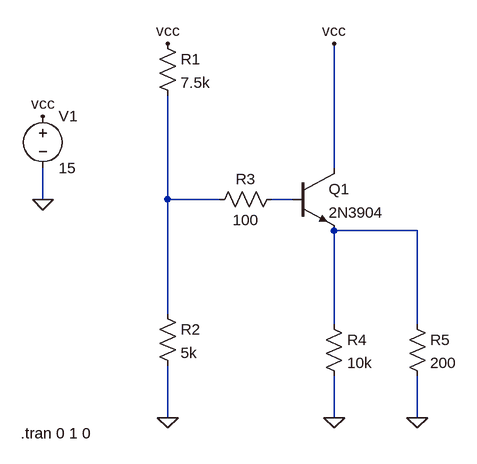
[diagram p0: schematic emiter-follower.asc]
emiter-follower.asc, the LTspice schematic file:
Version 4
SHEET 1 880 680
WIRE 512 192 512 0
WIRE 64 240 64 192
WIRE 256 240 256 80
WIRE 336 240 256 240
WIRE 448 240 416 240
WIRE 640 288 512 288
WIRE 256 416 256 240
WIRE 512 432 512 288
WIRE 640 432 640 288
WIRE 256 576 256 496
WIRE 512 576 512 512
WIRE 640 576 640 512
FLAG 64 240 0
FLAG 256 576 0
FLAG 512 576 0
FLAG 640 576 0
FLAG 64 112 vcc
FLAG 256 0 vcc
FLAG 512 0 vcc
SYMBOL voltage 64 96 R0
WINDOW 123 0 0 Left 0
WINDOW 39 0 0 Left 0
SYMATTR InstName V1
SYMATTR Value 15
SYMBOL npn 448 192 R0
SYMATTR InstName Q1
SYMATTR Value 2N3904
SYMBOL res 240 -16 R0
SYMATTR InstName R1
SYMATTR Value 7.5k
SYMBOL res 240 400 R0
SYMATTR InstName R2
SYMATTR Value 5k
SYMBOL res 496 416 R0
SYMATTR InstName R4
SYMATTR Value 10k
SYMBOL res 624 416 R0
SYMATTR InstName R5
SYMATTR Value 200
SYMBOL res 432 224 R90
WINDOW 0 0 56 VBottom 2
WINDOW 3 32 56 VTop 2
SYMATTR InstName R3
SYMATTR Value 100
TEXT 30 600 Left 2 !.tran 0 1 0

The netlist it stands for:
* emiter-follower.asc
V1 vcc 0 15
Q1 vcc N002 N003 0 2N3904
R1 vcc N001 7.5k
R2 N001 0 5k
R4 N003 0 10k
R5 N003 0 200
R3 N002 N001 100
.model NPN NPN
.model PNP PNP
.lib standard.bjt
.tran 0 1 0
.backanno
.end